# Altium schematic sheet 18.SchDoc
size 386 x 246 mm
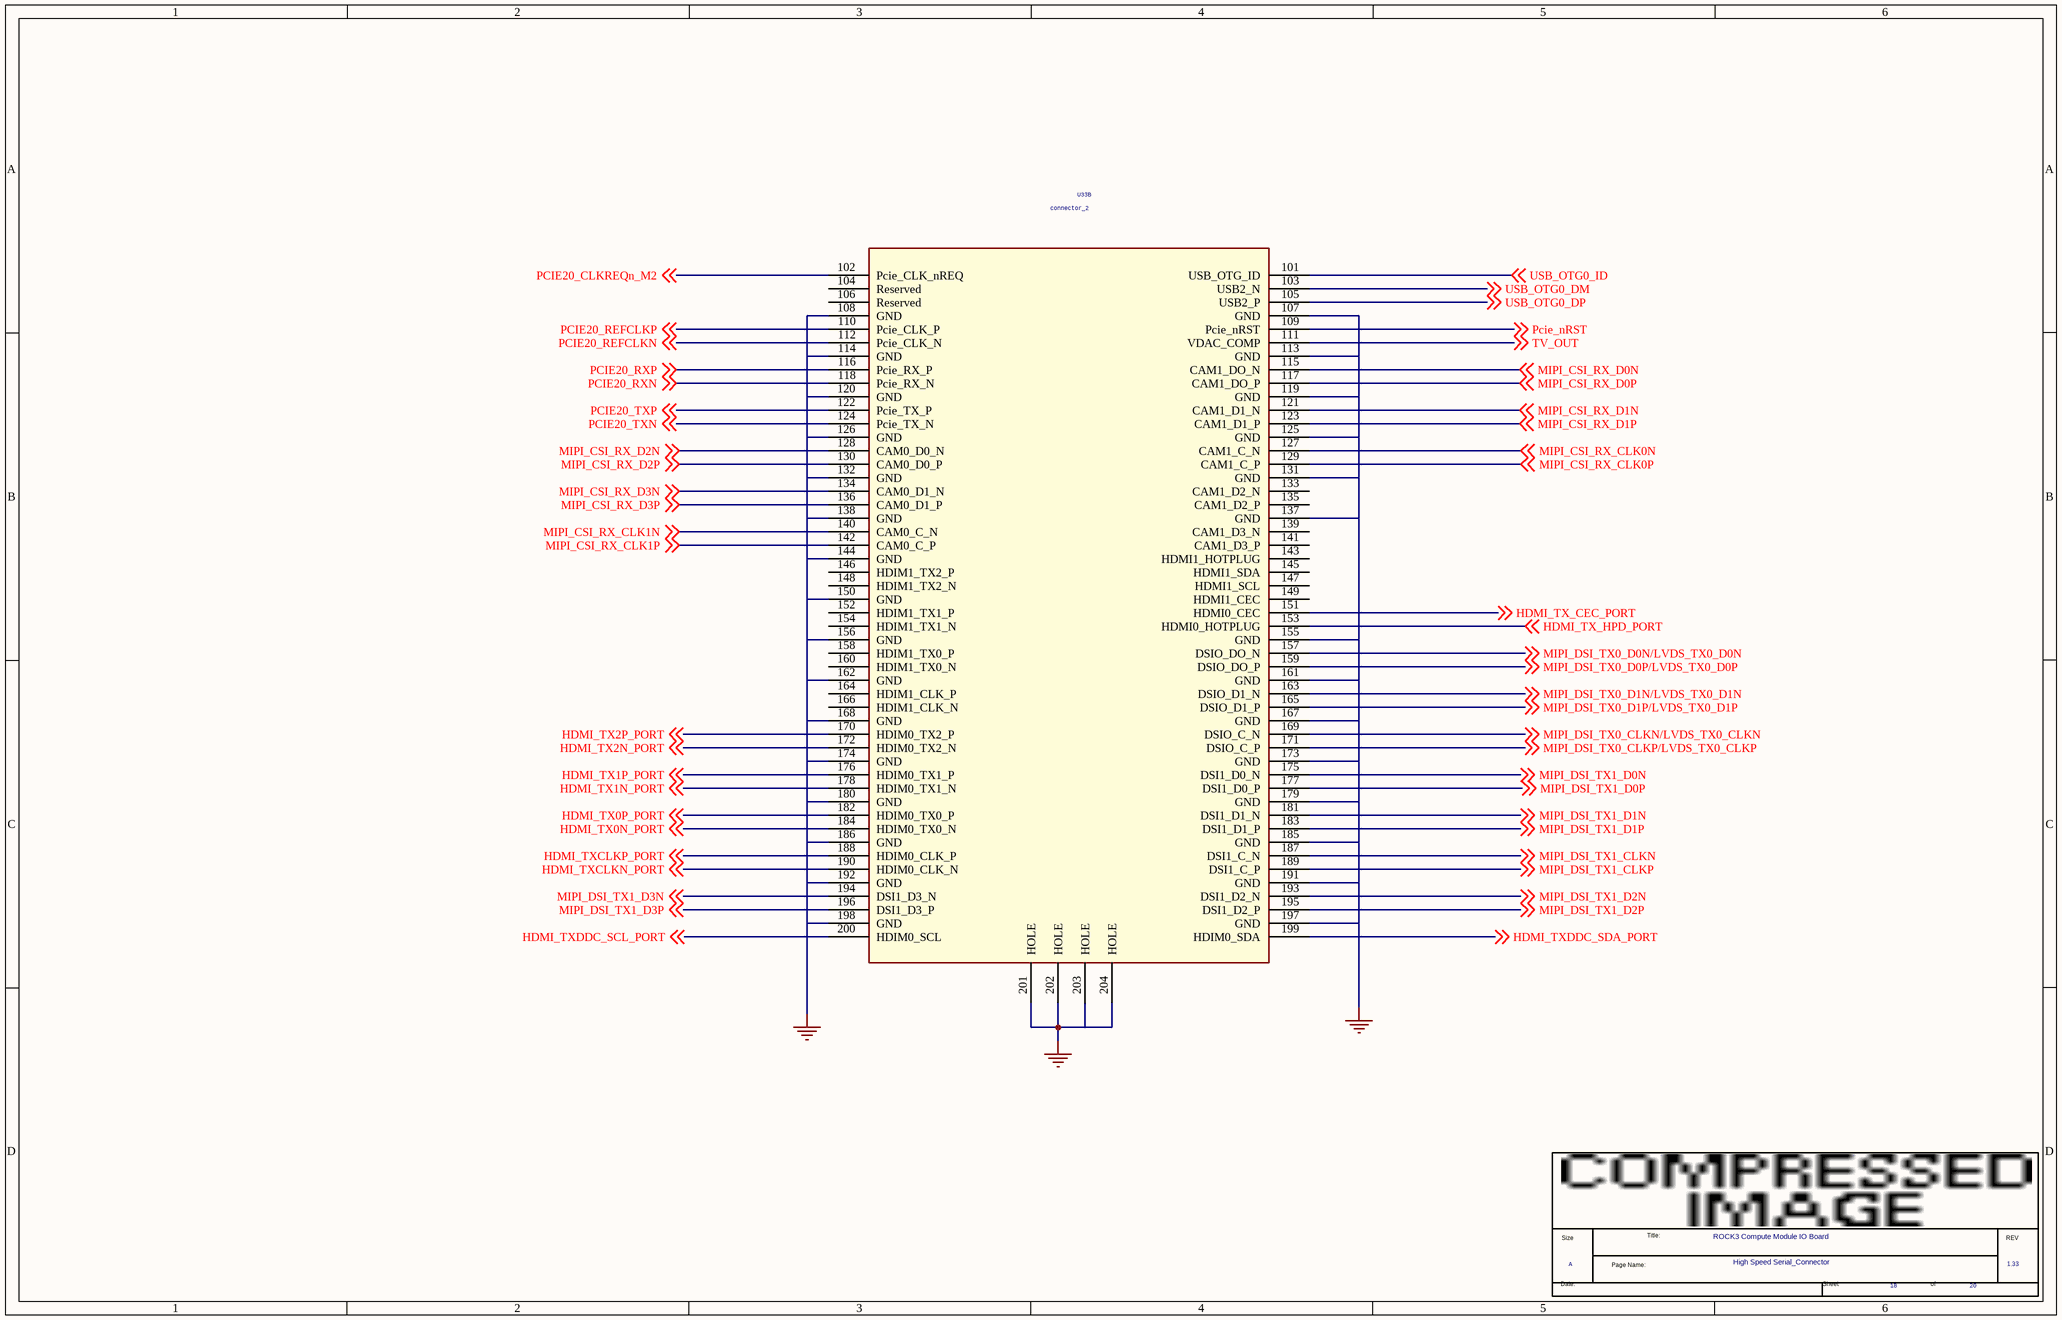
[diagram p0: 18.SchDoc]

## Parts
*  Page Count: 20  Page Number: 18  Page Size: A  Title: ROCK3 Compute Module IO Board  RevCode: 1.33  Doc: High Speed Serial_Connector  (hidden comment: radxa_1010)  (graphical)
U33  connector_2  [DF40C-200DS-D4-OK]  (part B of 2)

## Nets
GND: U33.107(GND) U33.108(GND) U33.113(GND) U33.114(GND) U33.119(GND) U33.120(GND) U33.125(GND) U33.126(GND) U33.131(GND) U33.132(GND) U33.137(GND) U33.138(GND) U33.144(GND) U33.150(GND) U33.155(GND) U33.156(GND) U33.161(GND) U33.162(GND) U33.167(GND) U33.168(GND) U33.173(GND) U33.174(GND) U33.179(GND) U33.180(GND) U33.185(GND) U33.186(GND) U33.191(GND) U33.192(GND) U33.197(GND) U33.198(GND) U33.201(HOLE) U33.202(HOLE) U33.203(HOLE) U33.204(HOLE)
HDMI_TX0N_PORT: U33.184(HDIM0_TX0_N) ; off-sheet HDMI_TX0N_PORT
HDMI_TX0P_PORT: U33.182(HDIM0_TX0_P) ; off-sheet HDMI_TX0P_PORT
HDMI_TX1N_PORT: U33.178(HDIM0_TX1_N) ; off-sheet HDMI_TX1N_PORT
HDMI_TX1P_PORT: U33.176(HDIM0_TX1_P) ; off-sheet HDMI_TX1P_PORT
HDMI_TX2N_PORT: U33.172(HDIM0_TX2_N) ; off-sheet HDMI_TX2N_PORT
HDMI_TX2P_PORT: U33.170(HDIM0_TX2_P) ; off-sheet HDMI_TX2P_PORT
HDMI_TX_CEC_PORT: U33.151(HDMI0_CEC) ; off-sheet HDMI_TX_CEC_PORT
HDMI_TX_HPD_PORT: U33.153(HDMI0_HOTPLUG) ; off-sheet HDMI_TX_HPD_PORT
HDMI_TXCLKN_PORT: U33.190(HDIM0_CLK_N) ; off-sheet HDMI_TXCLKN_PORT
HDMI_TXCLKP_PORT: U33.188(HDIM0_CLK_P) ; off-sheet HDMI_TXCLKP_PORT
HDMI_TXDDC_SCL_PORT: U33.200(HDIM0_SCL) ; off-sheet HDMI_TXDDC_SCL_PORT
HDMI_TXDDC_SDA_PORT: U33.199(HDIM0_SDA) ; off-sheet HDMI_TXDDC_SDA_PORT
MIPI_CSI_RX_CLK0N: U33.127(CAM1_C_N) ; off-sheet MIPI_CSI_RX_CLK0N
MIPI_CSI_RX_CLK0P: U33.129(CAM1_C_P) ; off-sheet MIPI_CSI_RX_CLK0P
MIPI_CSI_RX_CLK1N: U33.140(CAM0_C_N) ; off-sheet MIPI_CSI_RX_CLK1N
MIPI_CSI_RX_CLK1P: U33.142(CAM0_C_P) ; off-sheet MIPI_CSI_RX_CLK1P
MIPI_CSI_RX_D0N: U33.115(CAM1_DO_N) ; off-sheet MIPI_CSI_RX_D0N
MIPI_CSI_RX_D0P: U33.117(CAM1_DO_P) ; off-sheet MIPI_CSI_RX_D0P
MIPI_CSI_RX_D1N: U33.121(CAM1_D1_N) ; off-sheet MIPI_CSI_RX_D1N
MIPI_CSI_RX_D1P: U33.123(CAM1_D1_P) ; off-sheet MIPI_CSI_RX_D1P
MIPI_CSI_RX_D2N: U33.128(CAM0_D0_N) ; off-sheet MIPI_CSI_RX_D2N
MIPI_CSI_RX_D2P: U33.130(CAM0_D0_P) ; off-sheet MIPI_CSI_RX_D2P
MIPI_CSI_RX_D3N: U33.134(CAM0_D1_N) ; off-sheet MIPI_CSI_RX_D3N
MIPI_CSI_RX_D3P: U33.136(CAM0_D1_P) ; off-sheet MIPI_CSI_RX_D3P
MIPI_DSI_TX0_CLKN/LVDS_TX0_CLKN: U33.169(DSIO_C_N) ; off-sheet MIPI_DSI_TX0_CLKN/LVDS_TX0_CLKN
MIPI_DSI_TX0_CLKP/LVDS_TX0_CLKP: U33.171(DSIO_C_P) ; off-sheet MIPI_DSI_TX0_CLKP/LVDS_TX0_CLKP
MIPI_DSI_TX0_D0N/LVDS_TX0_D0N: U33.157(DSIO_DO_N) ; off-sheet MIPI_DSI_TX0_D0N/LVDS_TX0_D0N
MIPI_DSI_TX0_D0P/LVDS_TX0_D0P: U33.159(DSIO_DO_P) ; off-sheet MIPI_DSI_TX0_D0P/LVDS_TX0_D0P
MIPI_DSI_TX0_D1N/LVDS_TX0_D1N: U33.163(DSIO_D1_N) ; off-sheet MIPI_DSI_TX0_D1N/LVDS_TX0_D1N
MIPI_DSI_TX0_D1P/LVDS_TX0_D1P: U33.165(DSIO_D1_P) ; off-sheet MIPI_DSI_TX0_D1P/LVDS_TX0_D1P
MIPI_DSI_TX1_CLKN: U33.187(DSI1_C_N) ; off-sheet MIPI_DSI_TX1_CLKN
MIPI_DSI_TX1_CLKP: U33.189(DSI1_C_P) ; off-sheet MIPI_DSI_TX1_CLKP
MIPI_DSI_TX1_D0N: U33.175(DSI1_D0_N) ; off-sheet MIPI_DSI_TX1_D0N
MIPI_DSI_TX1_D0P: U33.177(DSI1_D0_P) ; off-sheet MIPI_DSI_TX1_D0P
MIPI_DSI_TX1_D1N: U33.181(DSI1_D1_N) ; off-sheet MIPI_DSI_TX1_D1N
MIPI_DSI_TX1_D1P: U33.183(DSI1_D1_P) ; off-sheet MIPI_DSI_TX1_D1P
MIPI_DSI_TX1_D2N: U33.193(DSI1_D2_N) ; off-sheet MIPI_DSI_TX1_D2N
MIPI_DSI_TX1_D2P: U33.195(DSI1_D2_P) ; off-sheet MIPI_DSI_TX1_D2P
MIPI_DSI_TX1_D3N: U33.194(DSI1_D3_N) ; off-sheet MIPI_DSI_TX1_D3N
MIPI_DSI_TX1_D3P: U33.196(DSI1_D3_P) ; off-sheet MIPI_DSI_TX1_D3P
PCIE20_CLKREQn_M2: U33.102(Pcie_CLK_nREQ) ; off-sheet PCIE20_CLKREQn_M2
PCIE20_REFCLKN: U33.112(Pcie_CLK_N) ; off-sheet PCIE20_REFCLKN
PCIE20_REFCLKP: U33.110(Pcie_CLK_P) ; off-sheet PCIE20_REFCLKP
PCIE20_RXN: U33.118(Pcie_RX_N) ; off-sheet PCIE20_RXN
PCIE20_RXP: U33.116(Pcie_RX_P) ; off-sheet PCIE20_RXP
PCIE20_TXN: U33.124(Pcie_TX_N) ; off-sheet PCIE20_TXN
PCIE20_TXP: U33.122(Pcie_TX_P) ; off-sheet PCIE20_TXP
Pcie_nRST: U33.109(Pcie_nRST) ; off-sheet Pcie_nRST
TV_OUT: U33.111(VDAC_COMP) ; off-sheet TV_OUT
USB_OTG0_DM: U33.103(USB2_N) ; off-sheet USB_OTG0_DM
USB_OTG0_DP: U33.105(USB2_P) ; off-sheet USB_OTG0_DP
USB_OTG0_ID: U33.101(USB_OTG_ID) ; off-sheet USB_OTG0_ID

Not connected (* = marked no-connect by the designer): U33 104(Reserved) 106(Reserved) 133(CAM1_D2_N) 135(CAM1_D2_P) 139(CAM1_D3_N) 141(CAM1_D3_P) 143(HDMI1_HOTPLUG) 145(HDMI1_SDA) 146(HDIM1_TX2_P) 147(HDMI1_SCL) 148(HDIM1_TX2_N) 149(HDMI1_CEC) 152(HDIM1_TX1_P) 154(HDIM1_TX1_N) 158(HDIM1_TX0_P) 160(HDIM1_TX0_N) 164(HDIM1_CLK_P) 166(HDIM1_CLK_N)

## Notes on the sheet
- (in symbol radxa_1010) Size; Title:; REV; Page Name:; Date:; Sheet; of

## Library data of the parts
U33 = HETER_4
* = radxa_1010: Page Create Date: March  8, 1995